# EAGLE design Doorbell With Power Supply (EAGLE 7.2.0)
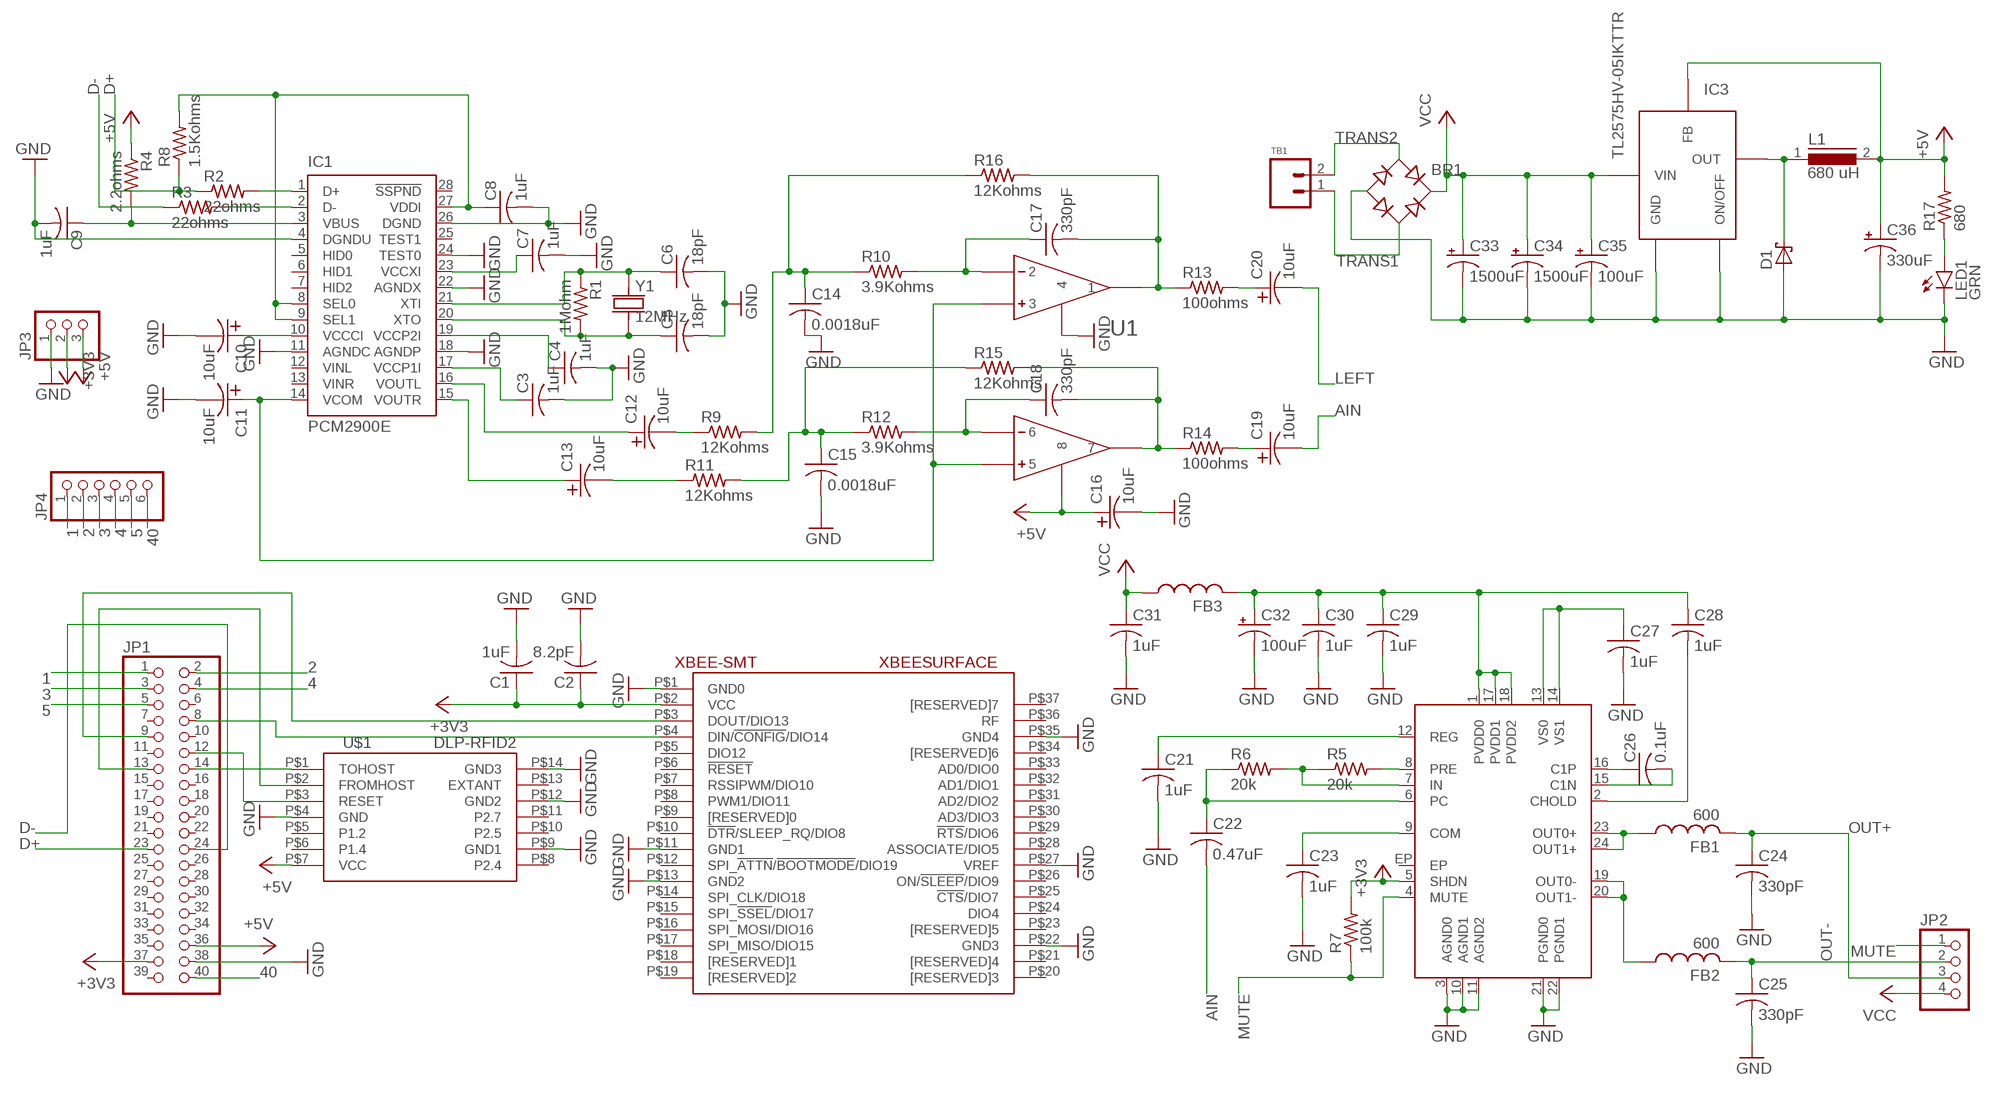
[diagram p0: schematic, sheet 1]

## Parts
BR1  BR  [DFS]
C1  1uF  CAP0603  [0603_CAP]
C2  8.2pF  CAP0603  [0603_CAP]
C3  1uF  CAP0603  [0603_CAP]
C4  1uF  CAP0603  [0603_CAP]
C5  18pF  CAP0603  [0603_CAP]
C6  18pF  CAP0603  [0603_CAP]
C7  1uF  CAP0603  [0603_CAP]
C8  1uF  CAP0603  [0603_CAP]
C9  1uF  CAP0603  [0603_CAP]
C10  10uF  CAP-TANT  [1411_CAP]
C11  10uF  CAP-TANT  [1411_CAP]
C12  10uF  CAP-TANT  [1411_CAP]
C13  10uF  CAP-TANT  [1411_CAP]
C14  0.0018uF  CAP0603  [0603_CAP]
C15  0.0018uF  CAP0603  [0603_CAP]
C16  10uF  CAP-TANT  [1411_CAP]
C17  330pF  CAP0603  [0603_CAP]
C18  330pF  CAP0603  [0603_CAP]
C19  10uF  CAP-TANT  [1411_CAP]
C20  10uF  CAP-TANT  [1411_CAP]
C21  1uF  CAP0603  [0603_CAP]
C22  0.47uF  CAP0603  [0603_CAP]
C23  1uF  CAP0603  [0603_CAP]
C24  330pF  CAP0603  [0603_CAP]
C25  330pF  CAP0603  [0603_CAP]
C26  0.1uF  CAP0603  [0603_CAP]
C27  1uF  CAP0603  [0603_CAP]
C28  1uF  CAP0603  [0603_CAP]
C29  1uF  CAP0603  [0603_CAP]
C30  1uF  CAP0603  [0603_CAP]
C31  1uF  CAP0603  [0603_CAP]
C32  100uF  CAP_POLF  [F_CAP]
C33  1500uF  CAP_POLJ16  [J16_CAP]
C34  1500uF  CAP_POLJ16  [J16_CAP]
C35  100uF  CAP_POLF  [F_CAP]
C36  330uF  CAP_POLF  [F_CAP]
D1  SCHOTTKY_DIODE  [SMD_DIODE]
FB1  600  FB0805  [0805_FB]
FB2  600  FB0805  [0805_FB]
FB3  FB0805  [0805_FB]
IC1  PCM2900E  [SSOP28DB]
IC2  MAX9737  [TQFN24]
IC3  TL2575HV-05IKTTR  TL2575  [TO-263-5]
JP1  PINHD-2X20  [2X20]
JP2  PINHD-1X4  [1X04]
JP3  PINHD-1X3  [1X03]
JP4  PINHD-1X6  [1X06]
L1  680 uH  DR125  [DR125]
LED1  GRN  LED0603  [0603_LED]
R1  1Mohm  RESISTOR0603  [0603_RESISTOR]
R2  22ohms  RESISTOR0603  [0603_RESISTOR]
R3  22ohms  RESISTOR0603  [0603_RESISTOR]
R4  2.2ohms  RESISTOR0603  [0603_RESISTOR]
R5  20k  RESISTOR0603  [0603_RESISTOR]
R6  20k  RESISTOR0603  [0603_RESISTOR]
R7  100k  RESISTOR0603  [0603_RESISTOR]
R8  1.5Kohms  RESISTOR0603  [0603_RESISTOR]
R9  12Kohms  RESISTOR0603  [0603_RESISTOR]
R10  3.9Kohms  RESISTOR0603  [0603_RESISTOR]
R11  12Kohms  RESISTOR0603  [0603_RESISTOR]
R12  3.9Kohms  RESISTOR0603  [0603_RESISTOR]
R13  100ohms  RESISTOR0603  [0603_RESISTOR]
R14  100ohms  RESISTOR0603  [0603_RESISTOR]
R15  12Kohms  RESISTOR0603  [0603_RESISTOR]
R16  12Kohms  RESISTOR0603  [0603_RESISTOR]
R17  680  RESISTOR0603  [0603_RESISTOR]
TB1  TERMINAL_BLOCK_2  [TERMINAL_BLOCK_2]
U1  OP-AMP  [OPA2353UA]
U$1  DLP-RFID2  [DLP-RFID2]
XBEE-SMT  XBEESURFACE  [XBEESURFACE]
Y1  12MHz  CRYSTAL5X3  [CRYSTAL_5X3]

## Nets
1: JP1.1 JP4.1
2: JP1.2 JP4.2
3: JP1.3 JP4.3
4: JP1.4 JP4.4
5: JP1.5 JP4.5
40: JP1.40 JP4.6
+3V3: C1.1 C2.1 IC2.5(SHDN) JP1.37 JP3.2 R7.2 XBEE-SMT.P$2(VCC)
+5V: C16.P$1 C36.+ IC3.4(FB) JP1.36 JP3.3 L1.2 R4.1 R17.2 U1.P$8 U$1.P$7(VCC)
AIN: C19.P$2 C22.2
D+: JP1.23 R2.1 R8.1
D-: JP1.24 R3.1
GND: BR1.- C1.2 C2.2 C3.2 C4.2 C5.2 C6.2 C7.2 C8.2 C9.2 C10.P$2 C11.P$2 C14.2 C15.2 C16.P$2 C21.2 C23.2 C24.2 C25.2 C27.2 C29.2 C30.2 C31.2 C32.- C33.- C34.- C35.- C36.- D1.A IC1.4(DGNDU) IC1.11(AGNDC) IC1.18(AGNDP) IC1.22(AGNDX) IC1.24(TEST0) IC1.26(DGND) IC2.3(AGND0) IC2.10(AGND1) IC2.11(AGND2) IC2.21(PGND0) IC2.22(PGND1) IC3.3(GND) IC3.5(ON/OFF) JP1.38 JP3.1 LED1.C U1.P$4 U$1.P$4(GND) U$1.P$9(GND1) U$1.P$12(GND2) U$1.P$14(GND3) XBEE-SMT.P$1(GND0) XBEE-SMT.P$11(GND1) XBEE-SMT.P$13(GND2) XBEE-SMT.P$22(GND3) XBEE-SMT.P$27(VREF) XBEE-SMT.P$35(GND4)
LEFT: C20.P$2
MUTE: IC2.4(MUTE) JP2.1 R7.1
N$1: JP1.14 U$1.P$1(TOHOST)
N$2: IC2.8(PRE) R5.2
N$3: IC2.7(IN) R5.1 R6.2
N$4: JP1.12 U$1.P$3(RESET)
N$5: JP1.13 U$1.P$2(FROMHOST)
N$6: JP1.8 XBEE-SMT.P$4(DIN/!CONFIG!/DIO14)
N$7: JP1.9 XBEE-SMT.P$3(DOUT/DIO13)
N$8: C3.1 IC1.17(VCCP1I)
N$9: IC1.1(D+) R2.2
N$10: C22.1 IC2.6(PC) R6.1
N$11: C8.1 IC1.8(SEL0) IC1.9(SEL1) IC1.27(VDDI) R8.2
N$12: IC1.2(D-) R3.2
N$13: C21.1 IC2.12(REG)
N$15: C7.1 IC1.23(VCCXI)
N$16: C6.1 IC1.21(XTI) R1.1 Y1.1
N$17: C5.1 IC1.20(XTO) R1.2 Y1.2
N$18: C4.1 IC1.19(VCCP2I)
N$19: C12.P$2 R9.1
N$20: C13.P$2 R11.1
N$21: C17.1 R10.2 U1.P$2
N$22: C10.P$1 IC1.10(VCCCI)
N$23: C11.P$1 IC1.14(VCOM) U1.P$3 U1.P$5
N$24: C18.1 R12.2 U1.P$6
N$25: C12.P$1 IC1.16(VOUTL)
N$26: C13.P$1 IC1.15(VOUTR)
N$27: C14.1 R9.2 R10.1 R16.1
N$28: C15.1 R11.2 R12.1 R15.1
N$29: C17.2 R13.1 R16.2 U1.P$1
N$30: C18.2 R14.1 R15.2 U1.P$7
N$32: D1.C IC3.2(OUT) L1.1
N$33: C20.P$1 R13.2
N$34: C19.P$1 R14.2
N$35: C9.1 IC1.3(VBUS) R4.2
N$37: C23.1 IC2.9(COM)
N$38: LED1.A R17.1
N$42: FB1.1 IC2.23(OUT0+) IC2.24(OUT1+)
N$44: FB2.1 IC2.19(OUT0-) IC2.20(OUT1-)
N$48: C26.1 IC2.16(C1P)
N$49: C26.2 IC2.15(C1N)
N$50: C28.2 IC2.2(CHOLD)
N$51: C28.1 C29.1 C30.1 C32.+ FB3.2 IC2.1(PVDD0) IC2.17(PVDD1) IC2.18(PVDD2)
N$52: C27.1 IC2.13(VS0) IC2.14(VS1)
OUT+: C24.1 FB1.2 JP2.3
OUT-: C25.1 FB2.2 JP2.2
TRANS1: BR1.AC2 TB1.1
TRANS2: BR1.AC1 TB1.2
VCC: BR1.+ C31.1 C33.+ C34.+ C35.+ FB3.1 IC3.1(VIN) JP2.4
Unconnected: IC1.5(HID0) IC1.6(HID1) IC1.7(HID2) IC1.12(VINL) IC1.13(VINR) IC1.25(TEST1) IC1.28(!SSPND) IC2.EP JP1.6 JP1.7 JP1.10 JP1.11 JP1.15 JP1.16 JP1.17 JP1.18 JP1.19 JP1.20 JP1.21 JP1.22 JP1.25 JP1.26 JP1.27 JP1.28 JP1.29 JP1.30 JP1.31 JP1.32 JP1.33 JP1.34 JP1.35 JP1.39 U$1.P$5(P1.2) U$1.P$6(P1.4) U$1.P$8(P2.4) U$1.P$10(P2.5) U$1.P$11(P2.7) U$1.P$13(EXTANT) XBEE-SMT.P$5(DIO12) XBEE-SMT.P$6(!RESET!) XBEE-SMT.P$7(RSSIPWM/DIO10) XBEE-SMT.P$8(PWM1/DIO11) XBEE-SMT.P$9([RESERVED]0) XBEE-SMT.P$10(!DTR!/SLEEP_RQ/DIO8) XBEE-SMT.P$12(SPI_!ATTN!/!BOOTMODE!/DIO19) XBEE-SMT.P$14(SPI_CLK/DIO18) XBEE-SMT.P$15(SPI_!SSEL!/DIO17) XBEE-SMT.P$16(SPI_MOSI/DIO16) XBEE-SMT.P$17(SPI_MISO/DIO15) XBEE-SMT.P$18([RESERVED]1) XBEE-SMT.P$19([RESERVED]2) XBEE-SMT.P$20([RESERVED]3) XBEE-SMT.P$21([RESERVED]4) XBEE-SMT.P$23([RESERVED]5) XBEE-SMT.P$24(DIO4) XBEE-SMT.P$25(!CTS!/DIO7) XBEE-SMT.P$26(ON/!SLEEP!/DIO9) XBEE-SMT.P$28(ASSOCIATE/DIO5) XBEE-SMT.P$29(!RTS!/DIO6) XBEE-SMT.P$30(AD3/DIO3) XBEE-SMT.P$31(AD2/DIO2) XBEE-SMT.P$32(AD1/DIO1) XBEE-SMT.P$33(AD0/DIO0) XBEE-SMT.P$34([RESERVED]6) XBEE-SMT.P$36(RF) XBEE-SMT.P$37([RESERVED]7)

## Library data of the parts
BR1 = jkf:BR; DIGIKEY#: 641-1425-1-ND; MANF: Comchip Technology; MANF#: DF206ST-G
C1-C9 C14 C15 C17 C18 C21-C31 = jkf:CAP
C10-C13 C16 C19 C20 = 1parts:CAP-TANT
C32-C36 = jkf:CAP_POL
D1 = jkf:SCHOTTKY_DIODE; DIGIKEY#: 1N5819HW-FDICT-ND; MANF: Diodes Inc; MANF#: 1N5819HW-7-F
FB1-FB3 = jkf:FB
IC1 = texas:PCM29*: STEREO AUDIO CODEC WITH USB INTERFACE SINGLE-ENDED ANALOG INPUT/OUTPUT AND S/PDIF; MF: TEXAS INSTRUMENTS; MPN: PCM2900E; OC_FARNELL: 1207086; OC_NEWARK: 75C5376
IC2 = jkf:MAX9737; DIGIKEY#: MAX9737ETG+TCT-ND; MANF: Maxim; MANF#: MAX9737ETG+T
IC3 = jkf:TL2575; DIGIKEY#: 296-21828-1-ND; MANF: Texas Instruments; MANF#: TL2575-33IKTTR
JP1 = pinhead:PINHD-2X20: PIN HEADER
JP2 = pinhead:PINHD-1X4: PIN HEADER
JP3 = pinhead:PINHD-1X3: PIN HEADER
JP4 = pinhead:PINHD-1X6: PIN HEADER
L1 = jkf:DR125; DIGIKEY#: SRR1208-102KLCT-ND; MANF: Bourns Inc.; MANF#: SRR1208-102KL
LED1 = jkf:LED; DIGIKEY#: 516-2493-1-ND; MANF: Avago Technologies; MANF#: HSMG-C191
R1-R17 = jkf:RESISTOR
TB1 = jkf:TERMINAL_BLOCK_2; DIGIKEY#: 277-2072-1-ND; MANF: Phoenix; MANF#: 1771091
U1 = 1parts:OP-AMP: Datasheet: http://www.ti.com/lit/ds/symlink/opa2353.pdf; DIGI-KEY: 296-26259-1-ND
U$1 = 1parts:DLP-RFID2
XBEE-SMT = 1parts:XBEESURFACE: Data Sheet: http://ftp1.digi.com/support/documentation/90002002_P.pdf
Y1 = jkf:CRYSTAL

## Board
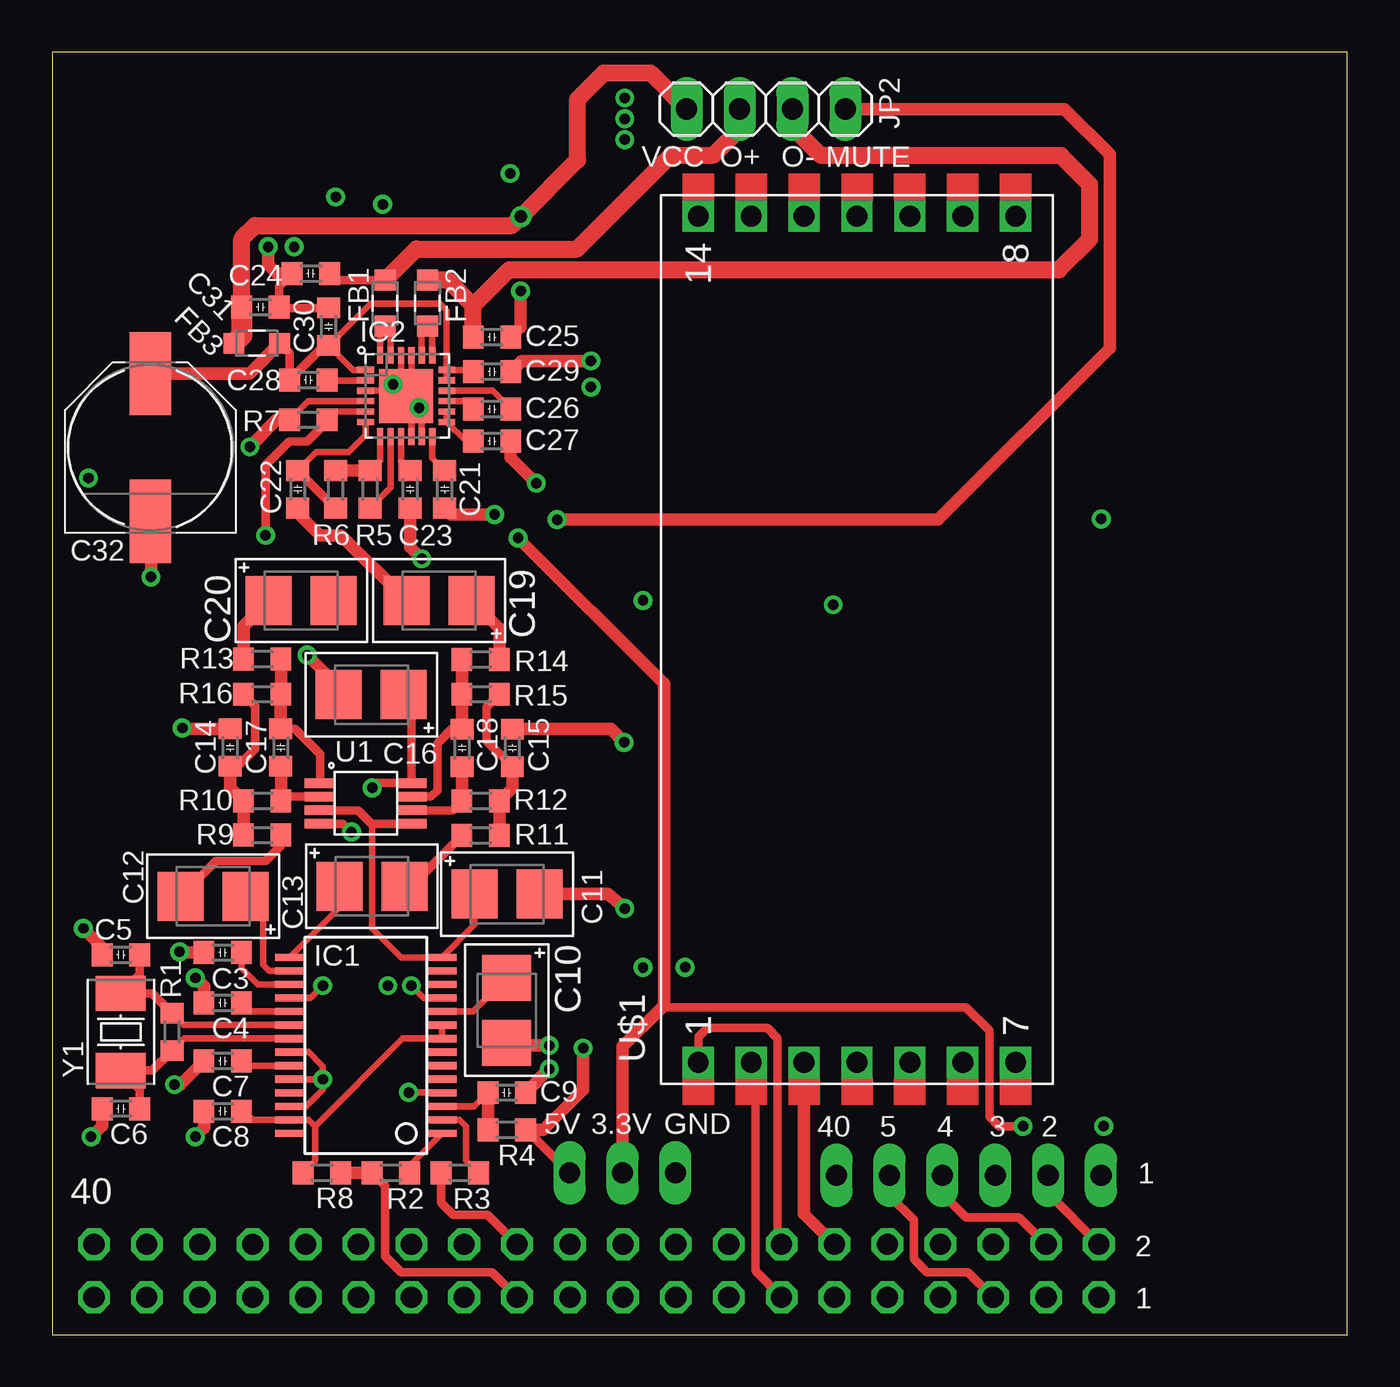
[diagram p1: board, top side]
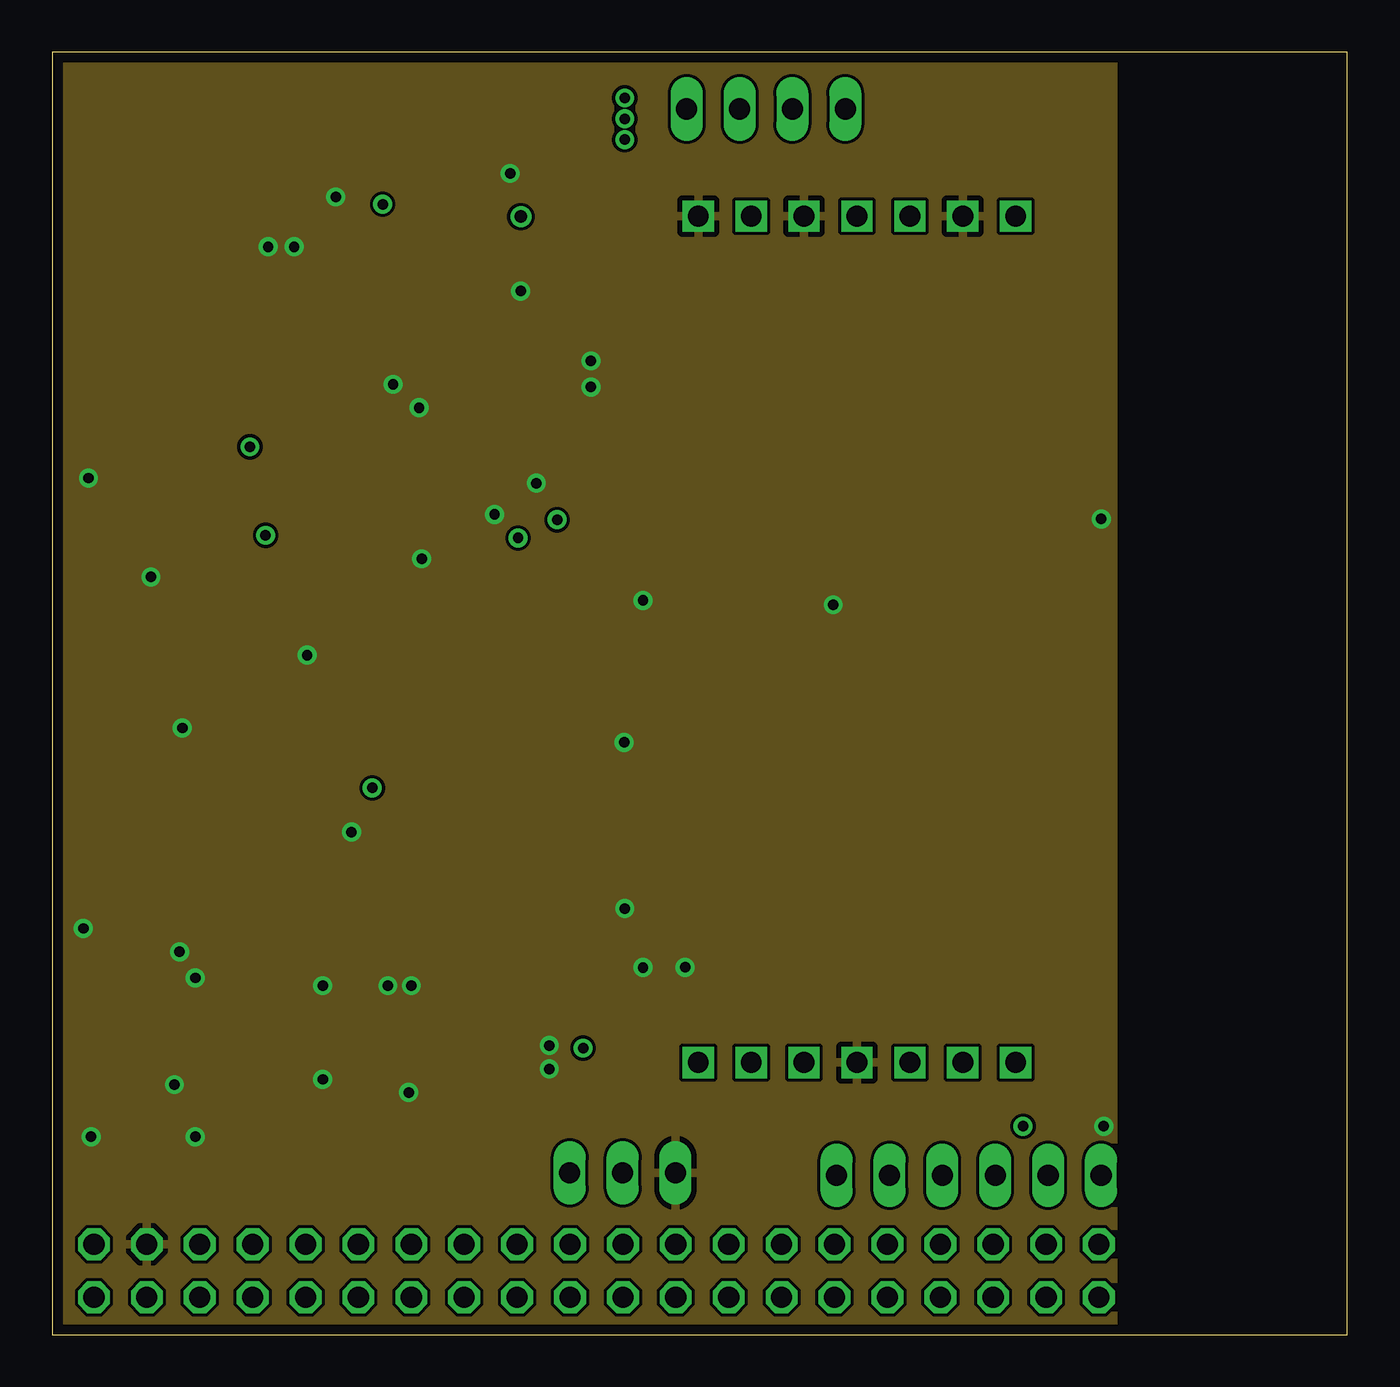
[diagram p2: board, inner layer GND]
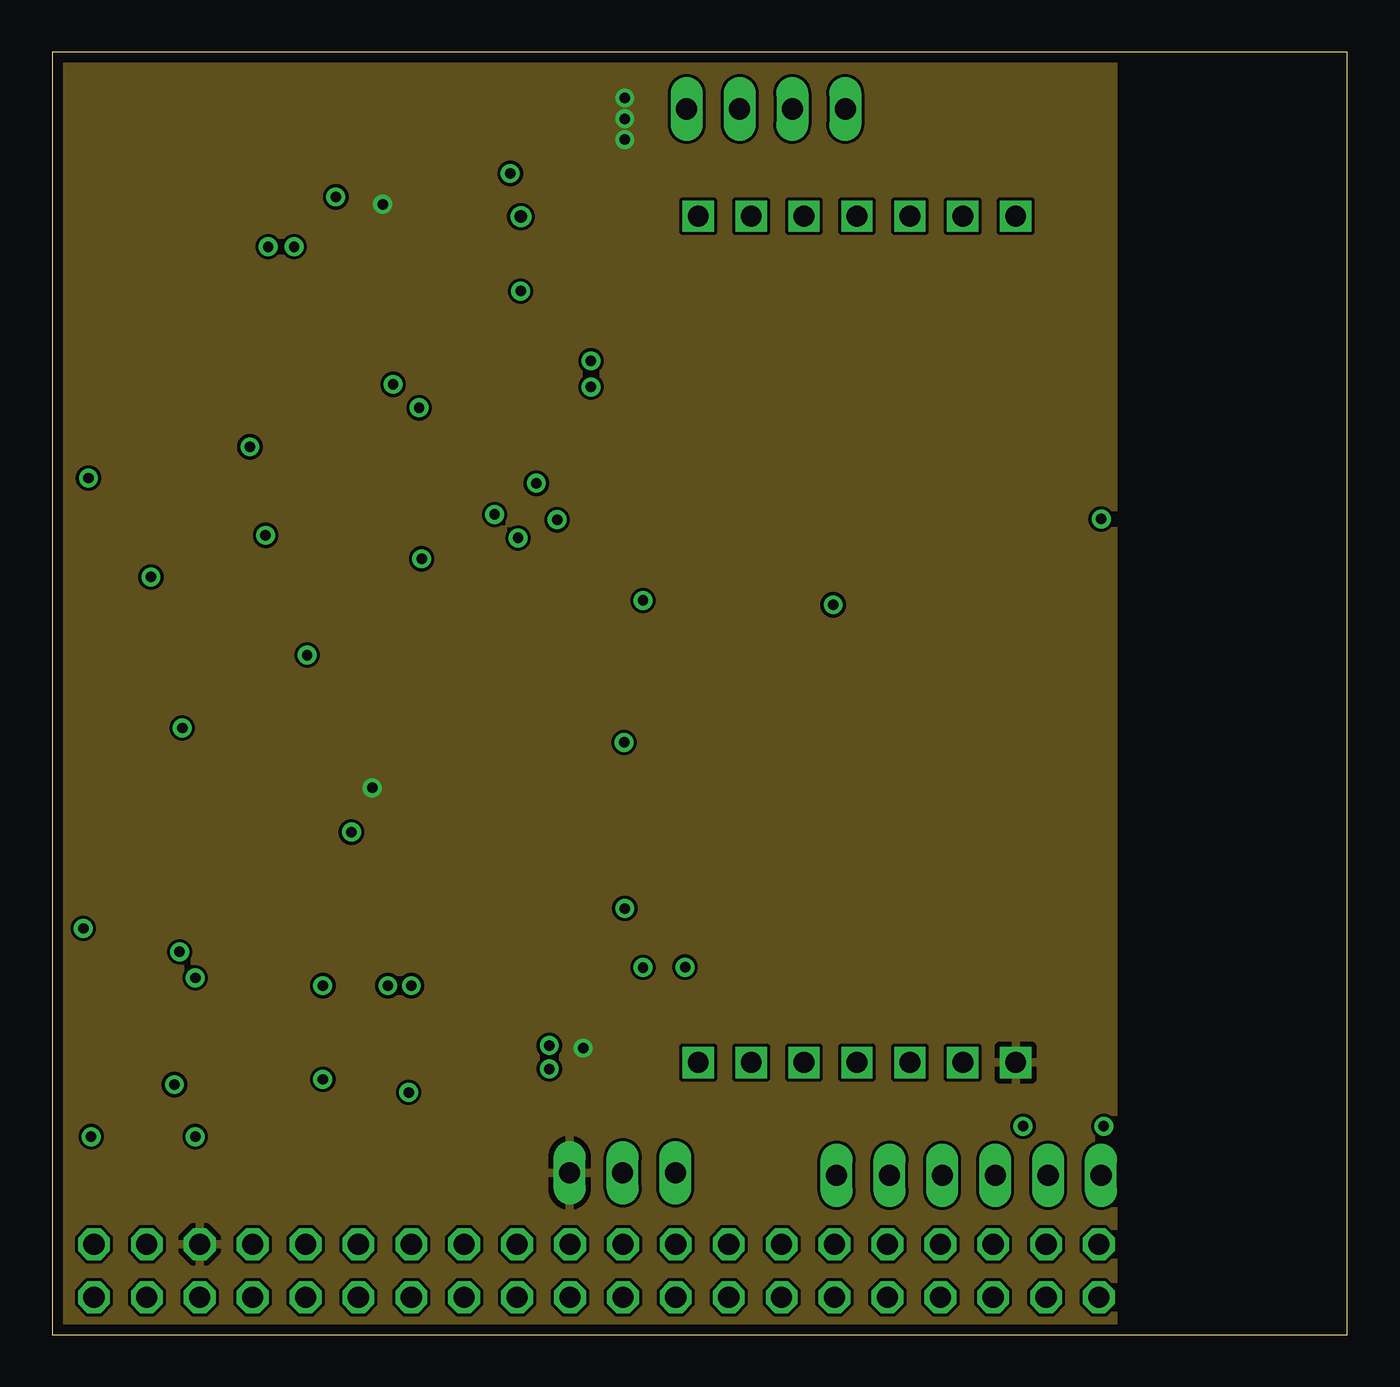
[diagram p3: board, inner layer +5V]
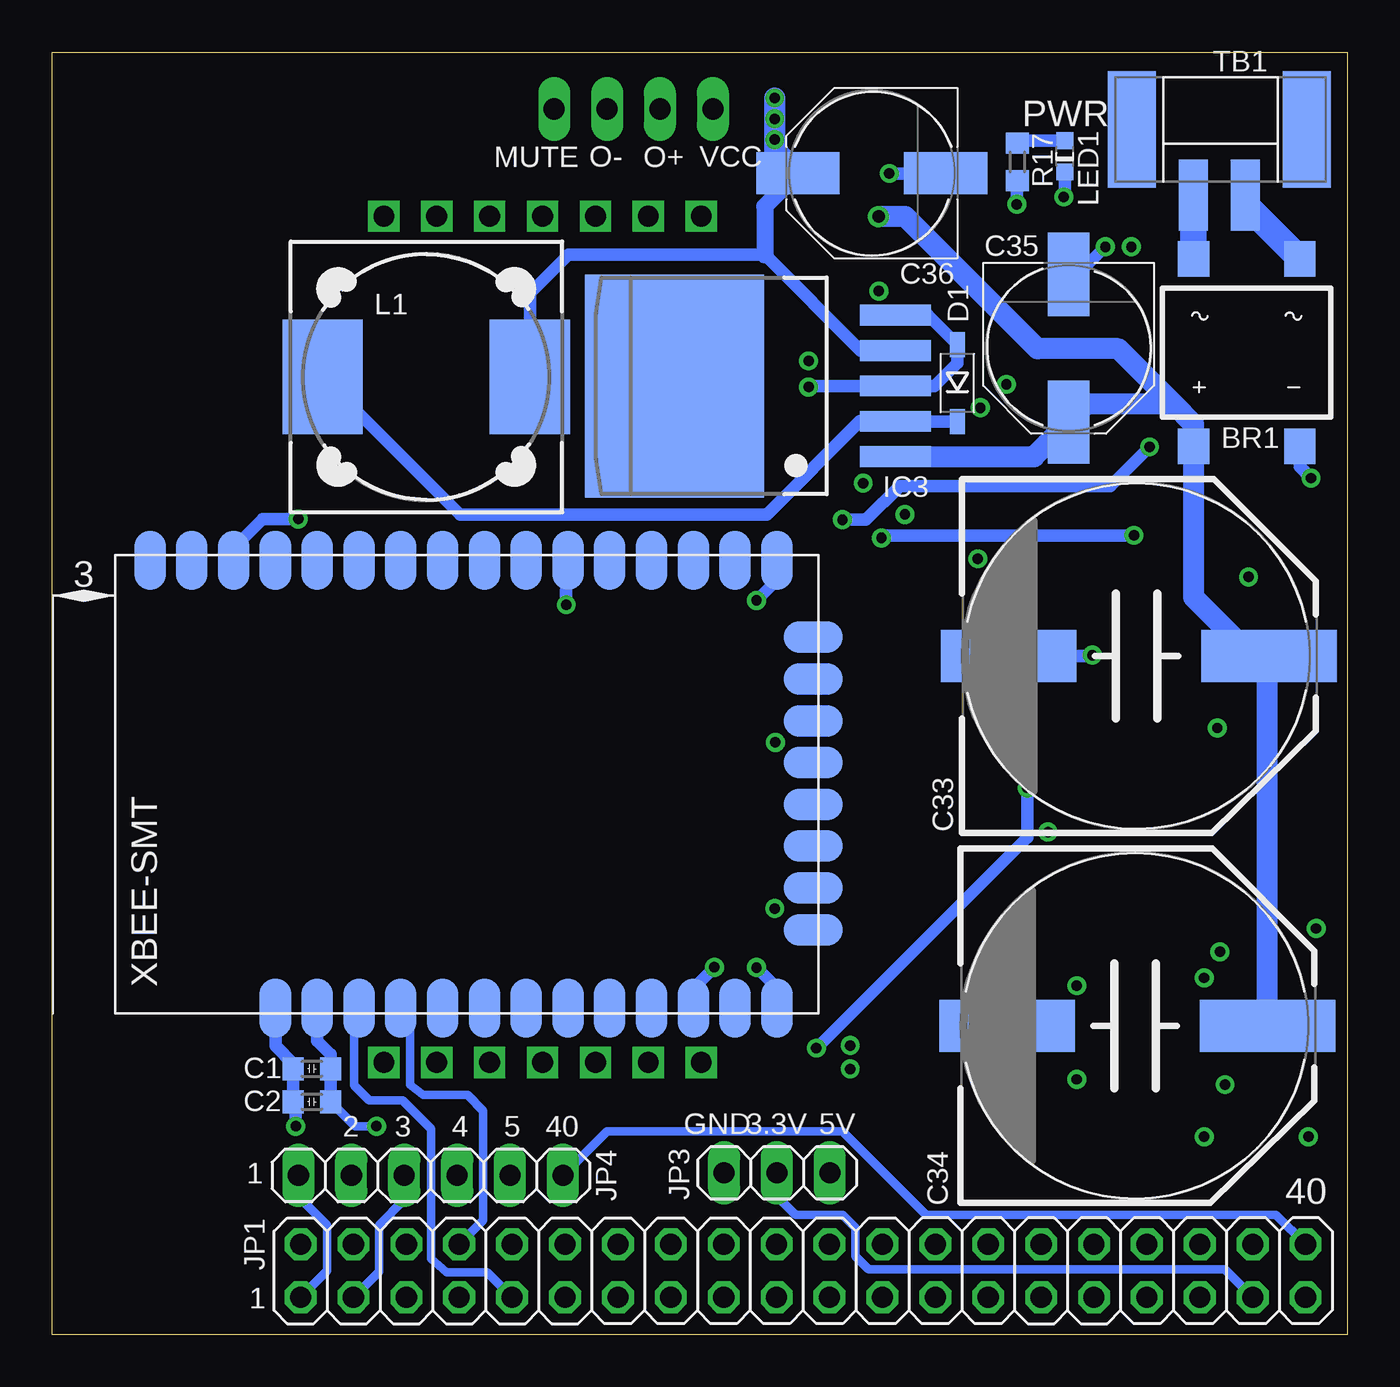
[diagram p4: board, bottom side, seen from below]

Size 62.2 x 61.58 mm. Coordinates in mm from the lower left corner, seen from the top.
Outline: 0,0 62.2,0 62.2,61.58 0,61.58 0,0
Copper layers (1+2*15+16): Top 0.0178mm / dielectric 12mil / GND 0.0356mm / dielectric 28mil / +5V 0.0356mm / dielectric 12mil / Bottom 0.0178mm
Design rules "SSC-EAGLE-4Lyr_v1.0.0.3": minimum track width 6mil, minimum drill 8mil, track to track 6mil, track to pad 6mil, pad to pad 6mil, via to via 6mil, smd to smd 6mil, copper to edge 20mil, drill to drill 16mil, minimum pad ring 8mil, minimum via ring 8mil, stop-mask expansion 3mil, vias tented up to drill 0mil, thermal gap 10mil

### Footprints (pad centres in the part's own frame; a part is rotated, then mirrored left to right if it is on the bottom)
DFS = smd 1.7 x 1.5: + -4.5,2.55; - -4.5,-2.55; AC1 4.5,2.55; AC2 4.5,-2.55
0603_CAP = smd 1 x 1.1: 1 -0.9,0; 2 0.9,0
1411_CAP = smd 2.21 x 2.35: P$1 -1.555,0; P$2 1.565,0
F_CAP = smd 4 x 2: + 3.55,0; - -3.55,0
J16_CAP = smd 6.5 x 2.5: + 6.248,0; - -6.252,0
SMD_DIODE = smd 1.2 x 0.7: A 1.85,0; C -1.85,0
0805_FB = smd 1 x 1: 1 -1.1,0; 2 1.1,0
SSOP28DB = smd 0.348 x 1.397: 1 -4.225,-3.656; 2 -3.575,-3.656; 3 -2.925,-3.656; 4 -2.275,-3.656; 5 -1.625,-3.656; 6 -0.975,-3.656; 7 -0.325,-3.656; 8 0.325,-3.656; 9 0.975,-3.656; 10 1.625,-3.656; 11 2.275,-3.656; 12 2.925,-3.656; 13 3.575,-3.656; 14 4.225,-3.656; 15 4.225,3.656; 16 3.575,3.656; 17 2.925,3.656; 18 2.275,3.656; 19 1.625,3.656; 20 0.975,3.656; 21 0.325,3.656; 22 -0.325,3.656; 23 -0.975,3.656; 24 -1.625,3.656; 25 -2.275,3.656; 26 -2.925,3.656; 27 -3.575,3.656; 28 -4.225,3.656
TQFN24 = smd 0.8 x 0.3: 1 -1.95,1.25; 2 -1.95,0.75; 3 -1.95,0.25; 4 -1.95,-0.25; 5 -1.95,-0.75; 6 -1.95,-1.25; 13 1.95,-1.25; 14 1.95,-0.75; 15 1.95,-0.25; 16 1.95,0.25; 17 1.95,0.75; 18 1.95,1.25 | smd 0.3 x 0.8: 7 -1.25,-1.95; 8 -0.75,-1.95; 9 -0.25,-1.95; 10 0.25,-1.95; 11 0.75,-1.95; 12 1.25,-1.95; 19 1.25,1.95; 20 0.75,1.95; 21 0.25,1.95; 22 -0.25,1.95; 23 -0.75,1.95; 24 -1.25,1.95 | smd 2.6 x 2.6: EP 0,0
TO-263-5 = smd 1 x 3.4: 1 -3.4,-8; 2 -1.7,-8; 3 0,-8; 4 1.7,-8; 5 3.4,-8 | smd 10.7 x 8.6: TAB 0,2.6
2X20 = drill 1.016 octagon: 1 -24.13,-1.27; 2 -24.13,1.27; 3 -21.59,-1.27; 4 -21.59,1.27; 5 -19.05,-1.27; 6 -19.05,1.27; 7 -16.51,-1.27; 8 -16.51,1.27; 9 -13.97,-1.27; 10 -13.97,1.27; 11 -11.43,-1.27; 12 -11.43,1.27; 13 -8.89,-1.27; 14 -8.89,1.27; 15 -6.35,-1.27; 16 -6.35,1.27; 17 -3.81,-1.27; 18 -3.81,1.27; 19 -1.27,-1.27; 20 -1.27,1.27; 21 1.27,-1.27; 22 1.27,1.27; 23 3.81,-1.27; 24 3.81,1.27; 25 6.35,-1.27; 26 6.35,1.27; 27 8.89,-1.27; 28 8.89,1.27; 29 11.43,-1.27; 30 11.43,1.27; 31 13.97,-1.27; 32 13.97,1.27; 33 16.51,-1.27; 34 16.51,1.27; 35 19.05,-1.27; 36 19.05,1.27; 37 21.59,-1.27; 38 21.59,1.27; 39 24.13,-1.27; 40 24.13,1.27
1X04 = drill 1.016 long: 1 -3.81,0; 2 -1.27,0; 3 1.27,0; 4 3.81,0
1X03 = drill 1.016 long: 1 -2.54,0; 2 0,0; 3 2.54,0
1X06 = drill 1.016 long: 1 -6.35,0; 2 -3.81,0; 3 -1.27,0; 4 1.27,0; 5 3.81,0; 6 6.35,0
DR125 = smd 3.85 x 5.5: 1 -4.975,0; 2 4.975,0
0603_LED = smd 0.8 x 0.8: A 0.75,0; C -0.75,0
0603_RESISTOR = smd 1 x 1.1: 1 -0.9,0; 2 0.9,0
TERMINAL_BLOCK_2 = smd 1.4 x 3.4: 1 1.25,-3.15; 2 -1.25,-3.15 | smd 2.3 x 5.6: P$1 4.2,0; P$2 -4.2,0
OPA2353UA = smd 0.45 x 1.45: P$1 -0.975,-2.2; P$2 -0.325,-2.2; P$3 0.325,-2.2; P$4 0.975,-2.2; P$5 0.975,2.2; P$6 0.325,2.2; P$7 -0.325,2.2; P$8 -0.975,2.2
DLP-RFID2 = drill 1 square: P$1 -20.32,7.62; P$2 -20.32,5.08; P$3 -20.32,2.54; P$4 -20.32,0; P$5 -20.32,-2.54; P$6 -20.32,-5.08; P$7 -20.32,-7.62; P$8 20.32,-7.62; P$9 20.32,-5.08; P$10 20.32,-2.54; P$11 20.32,0; P$12 20.32,2.54; P$13 20.32,5.08; P$14 20.32,7.62
XBEESURFACE = smd 2.845 x 1.524: P$1 -11.176,9.576; P$2 -11.176,7.569; P$3 -11.176,5.563; P$4 -11.176,3.556; P$5 -11.176,1.549; P$6 -11.176,-0.457; P$7 -11.176,-2.464; P$8 -11.176,-4.47; P$9 -11.176,-6.477; P$10 -11.176,-8.484; P$11 -11.176,-10.49; P$12 -11.176,-12.497; P$13 -11.176,-14.503; P$22 10.312,-14.503; P$23 10.312,-12.497; P$24 10.312,-10.49; P$25 10.312,-8.484; P$26 10.312,-6.477; P$27 10.312,-4.47; P$28 10.312,-2.464; P$29 10.312,-0.457; P$30 10.312,1.549; P$31 10.312,3.556; P$32 10.312,5.563; P$33 10.312,7.569; P$34 10.312,9.576; P$35 10.312,11.582; P$36 10.312,13.589; P$37 10.312,15.596 | smd 1.524 x 2.845: P$14 -7.417,-16.256; P$15 -5.41,-16.256; P$16 -3.404,-16.256; P$17 -1.397,-16.256; P$18 0.61,-16.256; P$19 2.616,-16.256; P$20 4.623,-16.256; P$21 6.629,-16.256
CRYSTAL_5X3 = smd 1.7 x 2.4: 1 -1.85,0; 2 1.85,0

### Placement (x,y rotation side)
BR1  4.84,47.16 90 bottom
C1  49.73,12.76 180 bottom
C2  49.73,11.18 180 bottom
C3  8.2,18.34 180 top
C4  8.2,15.93 180 top
C5  3.31,18.23 180 top
C6  3.31,10.85 180 top
C7  8.2,13.13 180 top
C8  8.2,10.72 180 top
C9  21.83,11.62 0 top
C10  21.83,15.57 270 top
C11  21.85,21.15 0 top
C12  7.74,21.05 180 top
C13  15.36,21.52 0 top
C14  8.55,28.18 90 top
C15  22.1,28.16 90 top
C16  15.34,30.73 180 top
C17  10.98,28.18 90 top
C18  19.68,28.16 90 top
C19  18.59,35.24 180 top
C20  11.96,35.24 0 top
C21  18.86,40.59 270 top
C22  11.8,40.59 270 top
C23  17.19,40.59 270 top
C24  12.42,50.95 180 top
C25  21.12,47.9 0 top
C26  21.12,44.44 180 top
C27  21.12,42.9 0 top
C28  12.3,45.84 0 top
C29  21.12,46.23 0 top
C30  13.28,48.4 90 top
C31  10.01,49.33 0 top
C32  4.72,42.59 90 top
C33  10.02,32.58 0 bottom
C34  10.09,14.83 0 bottom
C35  13.39,47.36 270 bottom
C36  22.84,55.77 180 bottom
D1  18.73,45.68 90 bottom
FB1  15.98,49.52 90 top
FB2  18.02,49.52 90 top
FB3  9.84,47.59 0 top
IC1  15.06,13.88 90 top
IC2  17,45.06 0 top
IC3  29.7,45.55 90 bottom
JP1  26.14,3.06 0 bottom
JP2  34.28,58.84 180 top
JP3  27.39,7.76 0 bottom
JP4  44.02,7.64 0 bottom
L1  44.23,45.98 0 bottom
LED1  13.56,56.57 90 bottom
R1  5.76,14.53 90 top
R2  16.27,7.76 0 top
R3  19.58,7.76 0 top
R4  21.83,9.82 180 top
R5  15.28,40.59 270 top
R6  13.61,40.59 90 top
R7  12.3,43.92 0 top
R8  12.96,7.76 180 top
R9  10.09,23.98 180 top
R10  10.09,25.62 0 top
R11  20.58,23.96 0 top
R12  20.58,25.62 180 top
R13  10.09,32.43 180 top
R14  20.58,32.41 0 top
R15  20.58,30.75 180 top
R16  10.09,30.75 0 top
R17  15.85,56.3 270 bottom
TB1  6.15,57.86 0 bottom
U1  15.06,25.5 270 top
U$1  38.65,33.38 90 top
XBEE-SMT  41.9,26.86 90 bottom
Y1  3.31,14.53 90 top

### Tracks (layer width: path | path; a pad name or v marks a point on that pad's centre or on a via)
1
  Bottom 0.406: JP1.1 49,3.06 49,5.25 50.37,6.62 JP4.1
2
  Top 0.406: JP1.2 47.83,6.77 JP4.2
3
  Bottom 0.406: JP1.3 46.5,3.02 46.5,5.25 45.29,6.46 JP4.3
4
  Top 0.406: JP1.4 46.44,5.62 43.88,5.62 42.75,6.75 JP4.4
5
  Top 0.406: JP1.5 43.98,3 42,3 41.38,3.62 41.38,5.5 40.21,6.67 JP4.5
40
  Bottom 0.406: JP1.40 3.43,5.75 20.25,5.75 24.25,9.75 35.56,9.75 JP4.6
+3V3  (via drill 0.5)
  Top 0.305: IC2.5 13.6,44.31 R7.2
  Top 0.406: v46.62,10 45.47,10 45,10.47 45,14.6 43.89,15.71 29.28,15.71 | R7.2 13.2,43.83 12.25,42.88 11.38,42.88 10.25,41.75 v10.25,38.38
  Top 0.61: v22.38,38.25 29.38,31.25 29.38,15.8 29.28,15.71 27.39,13.82 JP3.2
  Bottom 0.406: JP1.37 5.88,3.12 23,3.12 23.62,3.75 23.62,5.12 24.25,5.75 26.5,5.75 27.39,6.64 JP3.2 | v46.62,10 47.66,10 C2.1
  Bottom 0.61: XBEE-SMT.P$2 49.47,14.09 48.83,13.46 C1.1 C2.1 | v22.38,38.25 22.25,38.38 v10.25,38.38
+5V  (via drill 0.5)
  Top 0.406: JP3.3 22.8,9.82 R4.1 | C16.P$1 17.27,30.35 U1.P$8 15.6,26.48 v15.38,26.25
  Top 0.61: R4.1 23.57,9.82 25.5,11.75 v25.5,13.75
  Bottom 0.61: IC3.4 23.38,47.25 27.98,51.85 37.4,51.85 39.27,49.98 39.26,49.97 L1.2 | v25.5,13.75 15.38,23.88 v15.38,26.25 | v15.88,54.27 15.88,55.38 R17.2
  Bottom 0.813: C36.+ 27.98,54.17 27.98,51.85
  Bottom 1.016: 27.5,57.26 v27.5,57.38 | v27.5,57.38 v27.5,59.38 | C36.+ 27.5,56.88 v27.5,57.38
  other vias: 27.5,58.38
  pour +5V: 0,61.66 50.97,61.66 50.97,0 0,0
AIN
  Top 0.61: C19.P$2 13.88,38.38 12.88,38.38 11.8,39.45 C22.2
D+
  Top 0.406: JP1.23 21.12,3 16.75,3 16,3.75 16,7.13 R2.1
  Top 0.61: R2.1 R8.1
D-
  Top 0.406: JP1.24 20.91,5.75 19.25,5.75 18.68,6.32 R3.1
GND  (via drill 0.5)
  Top 0.305: IC1.26 12.21,10.96 13,11.75 v13,12.25 | IC1.24 v12.99,12.26 v13,12.25 | IC1.22 12.31,13.56 13,12.88 v13,12.25 | IC1.4 18.71,11.62 v17.12,11.62 | IC1.18 12.41,16.16 v13,16.75 | IC1.11 17.84,16.16 v17.25,16.75 | IC2.3 16.07,45.31 v16.38,45.62 16.75,46.01 IC2.22 | IC2.21 17.25,44.87 v17.62,44.5 | IC2.11 17.75,44.37 v17.62,44.5 | IC2.10 17.25,44.13 v17.62,44.5
  Top 0.406: C30.2 10.95,49.3 C31.2 10.91,50.34 C24.2 | U1.P$4 13.97,24.52 v14.38,24.12
  Top 0.61: C10.P$2 21.96,13.88 v23.88,13.88 | C6.2 2.4,10.03 v1.88,9.5 | C8.2 7.29,9.92 v6.88,9.5 | C4.2 7.29,16.7 v6.88,17.12 | C3.2 6.16,18.34 v6.12,18.38 | C5.2 2.4,18.59 v1.5,19.5 | C14.2 6.29,29.09 v6.25,29.12 | C16.P$2 13.77,31.11 v12.25,32.62 | C11.P$2 26.68,21.15 v27.5,20.45 | C32.- 4.75,39.07 | C9.2 v23.88,12.75 | C27.2 22.02,42.1 v23.25,40.88 | C24.2 10.8,50.95 10.38,51.38 v10.38,52.23 | C25.2 22.5,48.37 v22.5,50.1 | C23.2 17.19,37.81 v17.75,37.25 | C29.2 22.55,46.75 v25.88,46.75 | C21.2 19.17,39.38 v21.25,39.38 | 4.8,39.12 4.75,39.07 | 4.75,39.07 v4.75,36.38 | C7.2 6.16,12 v5.88,12 | C15.2 26.84,29.07 v27.47,28.43
  Bottom 0.61: XBEE-SMT.P$1 51.48,13.85 50.63,13.01 C1.2 C2.2 50.5,10.79 v50.5,10 | IC3.5 20.15,48.95 D1.A 18.73,46.65 19.82,45.55 IC3.3 25.82,45.55 v25.88,45.5 | XBEE-SMT.P$35 53.48,37.77 52.09,39.16 v50.38,39.16 | XBEE-SMT.P$27 37.5,36.6 v37.51,35.04 | C34.- 16.12,15.05 v16.12,16.75 | BR1.- 2.29,41.66 v1.75,41.12 | C33.- 12.29,32.58 v12.25,32.62 | C35.- 13.38,50.92 12.95,50.92 v11.62,52.23 | C36.- 19.27,55.75 v22,55.75 | LED1.C 13.56,54.69 v13.62,54.62 | XBEE-SMT.P$22 27.4,36.23 v28.38,35.25 | XBEE-SMT.P$13 27.4,16.65 v28.38,17.62 | XBEE-SMT.P$11 31.41,16.62 v30.39,17.64
  pour GND: 0,61.66 50.97,61.66 50.97,0 0,0
MUTE  (via drill 0.5)
  Top 0.305: IC2.4 12.29,44.81 R7.1
  Top 0.61: v9.5,42.62 10.79,43.92 R7.1 | v24.25,39.12 42.55,39.12 50.78,47.36 50.78,56.67 48.6,58.84 JP2.1
  Bottom 0.61: v24.25,39.12 23.12,39.12 21.5,40.75 11.38,40.75 v9.5,42.62
N$1
  Top 0.406: JP1.14 34.84,4.52 34.84,14.23 34.34,14.73 31.47,14.73 31.03,14.29 U$1.P$1
N$2
  Top 0.305: IC2.8 16.25,40.67 R5.2
N$3
  Top 0.305: IC2.7 15.76,41.97 R5.1
  Top 0.61: R5.1 R6.2
N$4
  Top 0.61: JP1.12 36.11,5.79 U$1.P$3
N$5
  Top 0.406: JP1.13 33.77,3.05 33.77,12.86 U$1.P$2
N$6
  Bottom 0.406: JP1.8 41.5,5.48 41.5,10.75 42.25,11.5 44.38,11.5 45,12 45,14.72 XBEE-SMT.P$4
N$7
  Bottom 0.406: JP1.9 41.32,3 43.25,3 44,3.62 44,9.88 45.38,11.25 46.98,11.25 47.69,11.96 47.69,15.45 XBEE-SMT.P$3
N$8
  Top 0.305: IC1.17 9.88,16.81 9.1,17.59 C3.1
N$9
  Top 0.305: IC1.1 17.17,8.11 R2.2
N$10
  Top 0.305: IC2.6 15.05,43.18 14.25,42.38 12.69,42.38 C22.1
  Top 0.406: R6.1 C22.1
N$11
  Top 0.305: C8.1 9.63,10.31 IC1.27 12.31,10.31 12.62,10 | 12.62,10 12.62,8.33 R8.2 | IC1.9 IC1.8 16.84,14.21 12.62,10
N$12
  Top 0.305: IC1.2 19.57,10.31 19.88,10 19.88,8.37 R3.2
N$13
  Top 0.305: IC2.12 18.25,42.09 C21.1
N$15
  Top 0.305: C7.1 9.45,12.91 IC1.23
N$16
  Top 0.305: R1.1 6.34,14.21 IC1.21
  Top 0.406: C6.1 4.21,11.78 Y1.1 4.81,12.68 R1.1
N$17
  Top 0.305: R1.2 6.33,14.86 IC1.20
  Top 0.406: C5.1 4.21,17.28 Y1.2 4.81,16.38 R1.2
N$18
  Top 0.305: C4.1 9.51,15.51 IC1.19
N$19
  Top 0.406: C12.P$2 7.88,22.75 10.25,22.75 10.99,23.49 R9.1
N$20
  Top 0.406: C13.P$2 17.25,21.52 R11.1
N$21
  Top 0.406: U1.P$2 11.19,25.82 R10.2
  Top 0.61: R10.2 C17.1
N$22
  Top 0.305: IC1.10 20.21,15.51 C10.P$1
N$23
  Top 0.305: C11.P$1 20.3,19.68 IC1.14 16.77,18.11 15.38,19.5 15.38,24.5 15.35,24.52
  Top 0.406: U1.P$3 14.7,25.18 15.35,24.52 U1.P$5
N$24
  Top 0.406: U1.P$6 19.23,25.18 R12.2
  Top 0.61: R12.2 C18.1
N$25
  Top 0.305: IC1.16 10.41,17.46 10.12,17.75 10.12,21 C12.P$1 10.12,20.88
N$26
  Top 0.305: IC1.15 13.8,20.5 C13.P$1
N$27
  Top 0.406: C14.1 8.91,27.29 9.75,28.12 9.75,30.18 R16.1
  Top 0.61: C14.1 8.55,26.27 R10.1 R9.2
N$28
  Top 0.406: C15.1 20.88,28.49 20.88,30.14 R15.1
  Top 0.61: C15.1 22.1,26.25 R12.1 R11.2
N$29
  Top 0.406: U1.P$1 12.87,27.89 11.66,29.09 C17.2
  Top 0.61: R13.1 R16.2 C17.2
N$30
  Top 0.406: U1.P$7 18.2,25.82 18.5,26.12 18.5,28.38 19.19,29.07 C18.2
  Top 0.61: R14.1 R15.2 C18.2
N$32
  Bottom 0.61: D1.C 21.68,43.83 IC3.2 23.4,43.85 27.88,39.38 42.6,39.38 L1.1
N$33
  Top 0.61: R13.2 9.19,34.02 C20.P$1
N$34
  Top 0.61: R14.2 21.48,33.9 C19.P$1
N$35
  Top 0.305: IC1.3 20.27,10.96 C9.1
  Top 0.61: R4.2 C9.1
N$37
  Top 0.305: IC2.9 16.75,41.92 C23.1
N$38
  Bottom 0.61: LED1.A 15.73,57.32 R17.1
N$42
  Top 0.305: IC2.24 15.76,48.19 FB1.1 16.25,48.15 IC2.23
N$44
  Top 0.305: IC2.20 17.75,48.15 FB2.1 18.25,48.19 IC2.19
N$48
  Top 0.305: IC2.16 21.14,45.31 C26.1
N$49
  Top 0.305: IC2.15 19.84,44.81 C26.2
N$50
  Top 0.305: IC2.2 13.22,45.81 C28.2
N$51
  Top 0.305: IC2.18 20.14,46.31 C29.1 | IC2.17 IC2.18 | IC2.1 14.46,46.31 C30.1 15.29,49.5 18.62,49.5 18.95,49.17 IC2.18
  Top 0.406: C30.1 13.06,47.49 C28.1 11.4,47.13 FB3.2
  Top 0.61: FB3.2 9.48,46.14 C32.+
N$52
  Top 0.305: C27.1 19.87,42.9 IC2.13 IC2.14
OUT+
  Top 0.406: FB1.2 13.64,50.62 C24.1
  Top 0.813: FB1.2 17.49,52.12 25.2,52.12 29.71,56.63 31.77,56.63 33.01,57.87 JP2.3
OUT-
  Top 0.813: C25.1 20.23,49.4 | 20.23,49.4 19,50.62 FB2.2 | 20.23,49.4 21.95,51.12 48.35,51.12 49.83,52.6 49.83,55.22 48.44,56.61 36.92,56.61 35.55,57.98 JP2.2
TRANS1
  Bottom 1.27: BR1.AC2 4.9,54.27 TB1.1
TRANS2
  Bottom 1.27: BR1.AC1 TB1.2
VCC  (via drill 0.6)
  Top 0.813: C31.1 9.11,52.61 9.75,53.25 22.08,53.25 v22.51,53.68 25.24,56.41 25.24,59.32 26.5,60.58 28.73,60.58 JP2.4
  Top 1.016: C31.1 9.11,47.97 FB3.1
  Bottom 1.016: C34.+ 3.84,31.86 | 3.84,31.86 3.84,32.51 C33.+ | IC3.1 15.05,42.15 C35.+ 12.51,44.69 8.36,44.69 | 8.36,44.69 7.39,43.72 BR1.+ 7.39,35.41 3.84,31.86 | 8.36,44.69 11,47.33 14.88,47.33 21.23,53.68 v22.51,53.68

### Text on the board
tNames: VCC | O+ | O- | MUTE | 5V | 3.3V | GND | 40 | 5 | 4 | 3 | 2 | 1 | 40 | 2 | 1
bNames: PWR | VCC | O+ | O- | MUTE | 5V | 3.3V | GND | 40 | 5 | 4 | 3 | 2 | 1 | 40 | 1